# Altium schematic sheet MCU.SchDoc
size A4
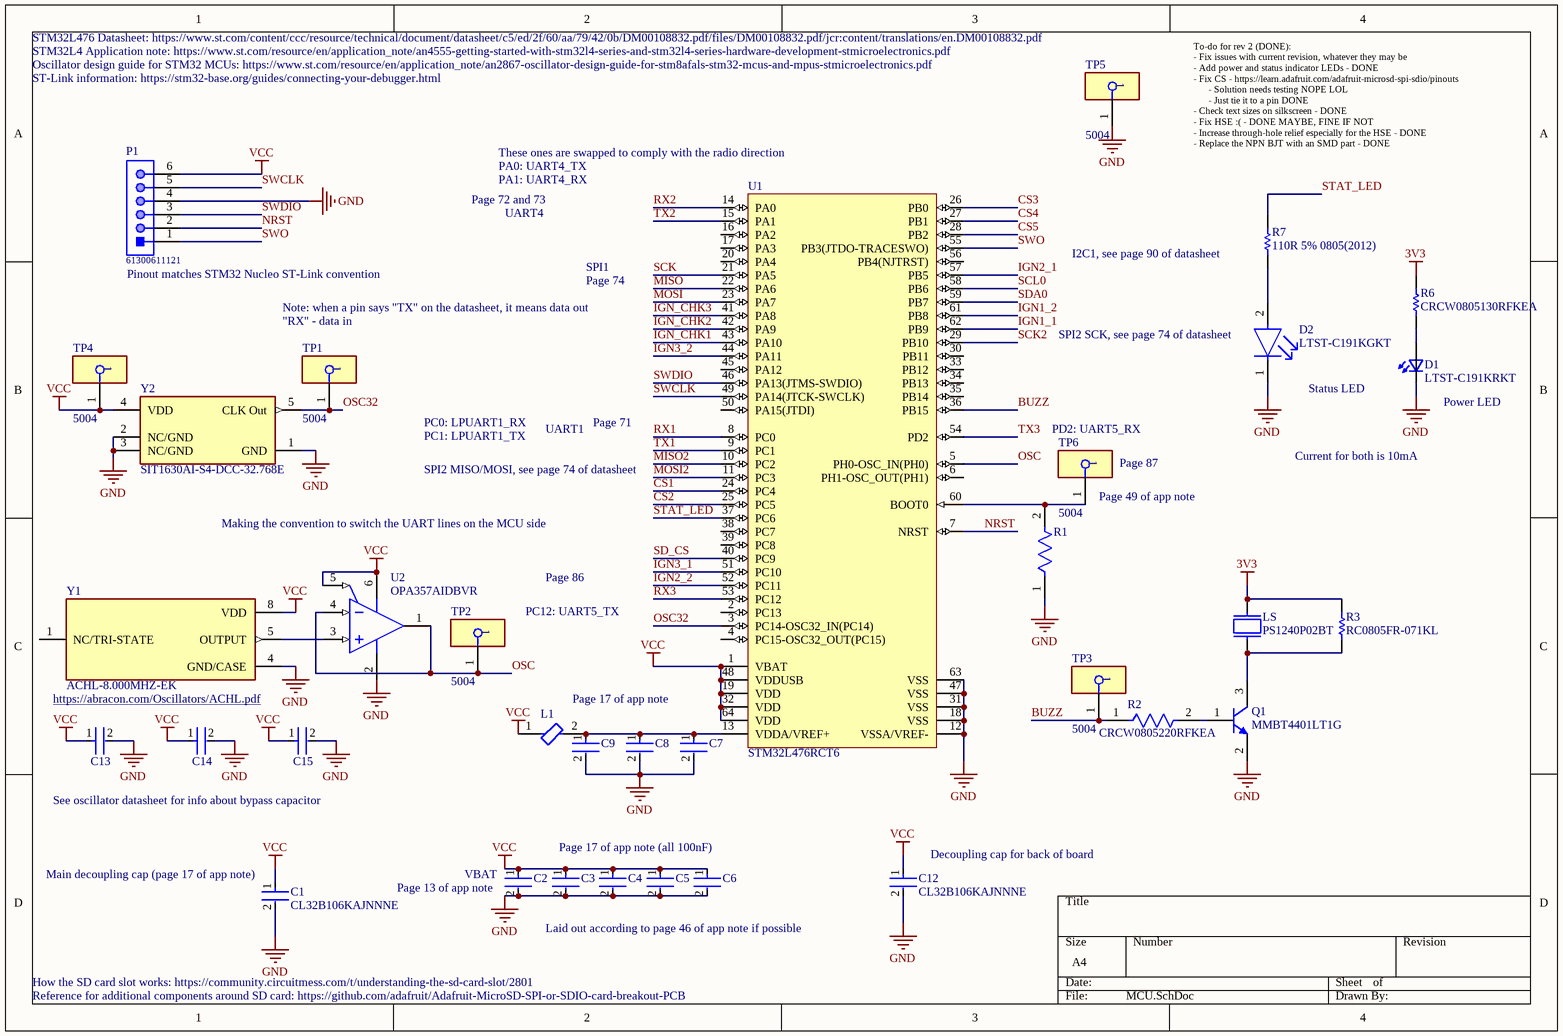
[diagram p0: MCU.SchDoc]

## Parts
C1  CL32B106KAJNNNE  [FP-CL32-IPC_B]
C2  CC0603KRX7R9BB104  [FP-CC0603-DA-MFG]  (value not drawn)
C3  CC0603KRX7R9BB104  [FP-CC0603-DA-MFG]  (value not drawn)
C4  CC0603KRX7R9BB104  [FP-CC0603-DA-MFG]  (value not drawn)
C5  CC0603KRX7R9BB104  [FP-CC0603-DA-MFG]  (value not drawn)
C6  CC0603KRX7R9BB104  [FP-CC0603-DA-MFG]  (value not drawn)
C7  CC0603KRX7R9BB104  [FP-CC0603-DA-MFG]  (value not drawn)
C8  CC0603KRX7R9BB103  [FP-CC0603-DA-MFG]  (value not drawn)
C9  CL10A105KO8NNNC  [FP-CL10-IPC_A]  (value not drawn)
C12  CL32B106KAJNNNE  [FP-CL32-IPC_B]
C13  CC0603KRX7R9BB103  [FP-CC0603-DA-MFG]  (value not drawn)
C14  CC0603KRX7R9BB103  [FP-CC0603-DA-MFG]  (value not drawn)
C15  CL10A105KO8NNNC  [FP-CL10-IPC_A]  (value not drawn)
D1  LTST-C191KRKT  [0603]
D2  LTST-C191KGKT  [FP-LTST-C191KGKT-MFG]
L1  BLM18EG601SN1D  [FP-BLM18-0_15-t0_8-MFG]  (value not drawn)
LS  PS1240P02BT  [XDCR_PS1240P02BT]
P1  61300611121  [61300611121]
Q1  MMBT4401LT1G  [ONSC-SOT-23-3-318-08_V]
R1  AC0805FR-0710KL  [FP-AC0805-MFG]  (value not drawn)
R2  CRCW0805220RFKEA  [FP-CRCW0805-e3-MFG]
R3  RC0805FR-071KL  [RESC2013X60X35ML10T20]
R6  CRCW0805130RFKEA  [RESC2013X50X30ML20T20]
R7  110R 5% 0805(2012)  [RESC0805(2012)_N]
TP1  5004  [FP-5004-MFG]
TP2  5004  [FP-5004-MFG]
TP3  5004  [FP-5004-MFG]
TP4  5004  [FP-5004-MFG]
TP5  5004  [FP-5004-MFG]
TP6  5004  [FP-5004-MFG]
U1  STM32L476RCT6  [STM-LQFP64_L]
U2  OPA357AIDBVR  [DBV0006A_L]
Y1  ACHL-8.000MHZ-EK  [XTAL_ACHL-8.000MHZ-EK]
Y2  SIT1630AI-S4-DCC-32.768E  [FP-SiT1630-S-IPC_A]

## Nets
3V3: LS.2 R3.2 R6.2
GND: C1.2 C2.2 C3.2 C4.2 C5.2 C6.2 C7.2 C8.2 C9.2 C12.2 C13.2 C14.2 C15.2 D1.1(K2) D2.1(C) P1.4 Q1.2(E) R1.1 TP5.1 U1.12(VSSA/VREF-) U1.18(VSS) U1.31(VSS) U1.47(VSS) U1.63(VSS) U2.2(V-) Y1.4(GND/CASE) Y2.1(GND) Y2.2(NC/GND) Y2.3(NC/GND)
VCC: C1.1 C2.1 C3.1 C4.1 C5.1 C6.1 C12.1 C13.1 C14.1 C15.1 L1.1 P1.6 TP4.1 U1.1(VBAT) U1.19(VDD) U1.32(VDD) U1.48(VDDUSB) U1.64(VDD) U2.5(ENABLE) U2.6(V+) Y1.8(VDD) Y2.4(VDD)
BUZZ: R2.1 TP3.1 U1.36(PB15)
CS1: U1.24(PC4)
CS2: U1.25(PC5)
CS3: U1.26(PB0)
CS4: U1.27(PB1)
CS5: U1.28(PB2)
IGN1_1: U1.62(PB9)
IGN1_2: U1.61(PB8)
IGN2_1: U1.57(PB5)
IGN2_2: U1.52(PC11)
IGN3_1: U1.51(PC10)
IGN3_2: U1.44(PA11)
IGN_CHK1: U1.43(PA10)
IGN_CHK2: U1.42(PA9)
IGN_CHK3: U1.41(PA8)
MISO: U1.22(PA6)
MISO2: U1.10(PC2)
MOSI: U1.23(PA7)
MOSI2: U1.11(PC3)
NRST: P1.2 U1.7(NRST)
OSC: TP2.1 U1.5(PH0-OSC_IN(PH0)) U2.1(OUT) U2.4(IN-)
OSC32: TP1.1 U1.3(PC14-OSC32_IN(PC14)) Y2.5(CLK_Out)
RX1: U1.8(PC0)
RX2: U1.14(PA0)
RX3: U1.53(PC12)
SCK: U1.21(PA5)
SCK2: U1.29(PB10)
SCL0: U1.58(PB6)
SD_CS: U1.40(PC9)
SDA0: U1.59(PB7)
STAT_LED: R7.2 U1.37(PC6)
SWCLK: P1.5 U1.49(PA14(JTCK-SWCLK))
SWDIO: P1.3 U1.46(PA13(JTMS-SWDIO))
SWO: P1.1 U1.55(PB3(JTDO-TRACESWO))
TX1: U1.9(PC1)
TX2: U1.15(PA1)
TX3: U1.54(PD2)
NetC7_1: C7.1 C8.1 C9.1 L1.2 U1.13(VDDA/VREF+)
NetD1_2: D1.2(A2) R6.1
NetD2_2: D2.2(A) R7.1
NetLS_1: LS.1 Q1.3(C) R3.1
NetQ1_1: Q1.1(B) R2.2
NetR1_2: R1.2 TP6.1 U1.60(BOOT0)
NetU2_3: U2.3(IN+) Y1.5(OUTPUT)

Not connected (* = marked no-connect by the designer): U1 2(PC13) 4(PC15-OSC32_OUT(PC15)) 6(PH1-OSC_OUT(PH1)) 16(PA2) 17(PA3) 20(PA4) 30(PB11) 33(PB12) 34(PB13) 35(PB14) 38(PC7) 39(PC8) 45(PA12) 50(PA15(JTDI)) 56(PB4(NJTRST)); Y1 1(NC/TRI-STATE)

## Notes on the sheet
- STM32L476 Datasheet: https://www.st.com/content/ccc/resource/technical/document/datasheet/c5/ed/2f/60/aa/79/42/0b/DM00108832.pdf/files/DM00108832.pdf/jcr:content/translations/en.DM00108832.pdf
- (near TP5) STM32L4 Application note: https://www.st.com/resource/en/application_note/an4555-getting-started-with-stm32l4-series-and-stm32l4-series-hardware-development-stmicroelectronics.pdf
- ST-Link information: https://stm32-base.org/guides/connecting-your-debugger.html
- (near TP5) Oscillator design guide for STM32 MCUs: https://www.st.com/resource/en/application_note/an2867-oscillator-design-guide-for-stm8afals-stm32-mcus-and-mpus-stmicroelectronics.pdf
- (near U1) These ones are swapped to comply with the radio direction
- PA0: UART4_TX
- To-do for rev 2 (DONE):
  - Fix issues with current revision, whatever they may be
  - Add power and status indicator LEDs - DONE
  - Fix CS - https://learn.adafruit.com/adafruit-microsd-spi-sdio/pinouts
  - Solution needs testing NOPE LOL
  - Just tie it to a pin DONE
  - Check text sizes on silkscreen - DONE
  - Fix HSE :( - DONE MAYBE, FINE IF NOT
  - Increase through-hole relief especially for the HSE - DONE
  - Replace the NPN BJT with an SMD part - DONE
- Page 72 and 73
- PA1: UART4_RX
- UART4
- (near P1) Pinout matches STM32 Nucleo ST-Link convention
- Note: when a pin says "TX" on the datasheet, it means data out
- Page 74
- SPI1
- (near R7) I2C1, see page 90 of datasheet
- "RX" - data in
- (near D2) SPI2 SCK, see page 74 of datasheet
- PC0: LPUART1_RX
- PC1: LPUART1_TX
- UART1
- Page 71
- (near TP6) PD2: UART5_RX
- Status LED
- (near D1) Power LED
- SPI2 MISO/MOSI, see page 74 of datasheet
- (near TP6) Page 49 of app note
- (near TP6) Page 87
- Current for both is 10mA
- Making the convention to switch the UART lines on the MCU side
- Page 86
- PC12: UART5_TX
- https://abracon.com/Oscillators/ACHL.pdf
- Page 17 of app note
- See oscillator datasheet for info about bypass capacitor
- Page 17 of app note (all 100nF)
- (near C1) Main decoupling cap (page 17 of app note)
- (near C2) Page 13 of app note
- (near C2) VBAT
- (near C12) Decoupling cap for back of board
- How the SD card slot works: https://community.circuitmess.com/t/understanding-the-sd-card-slot/2801
- Laid out according to page 46 of app note if possible
- Reference for additional components around SD card: https://github.com/adafruit/Adafruit-MicroSD-SPI-or-SDIO-card-breakout-PCB

## Library data of the parts
C1 C12 = CMP-13271-001383-1: Cap Ceramic 10uF 25V X7R ±10% SMD 1210 +125°C Embossed T/R; Capacitance: 10uF; Width: 0.098inch; Min Operating Temperature: -55°C; Case Code (Metric): 3225; Case Code (Imperial): 1210; Material: Ceramic; Height: 2.5mm; Depth: 2.5mm; Contact Plating: Tin; Max Operating Temperature: 125°C; Length: 3.2mm; Mount: Surface Mount; Packaging: Tape and Reel; Dielectric: X7R; Tolerance: 10%; Radiation Hardening: No; Thickness: 0.106inch; Package Quantity: 1000; Voltage Rating: 25V; Voltage: 25V; Case/Package: 1210; LCSC Part #: C39232
C2-C7 = CMP-2100-03601-2: CAP CER 0.1UF 50V X7R 0603; Manufacturer: YAGEO; Material: Ceramic; Capacitance: 100 nF; Temperature Coefficient: 15%; Tolerance: 0.1; Value: 100 nF; Height: 0.9mm; Voltage: 50 V; ComponentLink2Description: Datasheet; Device Class L2: Capacitors; Temperature Range High: +125°C; Category: Cap; Footprint Url: http://www.yageo.com/exep/pages/download/literatures/UPY-C_GEN_24.pdf; ComponentLink2URL: http://www.yageo.com/documents/recent/UPY-GPHC_X7R_6.3V-to-50V_18.pdf; Package: CC0603-DA; Temperature: -55°C to +125°C; Voltage Rating: 50 V; Temperature Characteristic: X7R; Device Class L1: Passive Components; Temperature Range Low: -55°C; Manufacturer Part Number: CC0603KRX7R9BB104; RoHS: TRUE; Automotive: No; Device Class L3: Ceramic Capacitors; Octopart: https://octopart.com/cc0603krx7r9bb104-yageo-42244635; Mouser Description: Multilayer Ceramic Capacitor, CC Series, 0.1 - F, - 10%, X7R, 50 V, 0603 [1608 Metric]; Lead Free: Yes; Digikey Description: CAP CER 0.1UF 50V X7R 0603; LCSC Part #: C14663
C8 C13 C14 = CMP-2100-03600-2: CAP CER 10000PF 50V X7R 0603; Manufacturer: YAGEO; Tolerance: 0.1; Material: Ceramic; Temperature Coefficient: 15%; Value: 10 nF; Mouser Description: Multilayer Ceramic Capacitor, CC Series, 0.01 - F, - 10%, X7R, 50 V, 0603 [1608 Metric]; Digikey Description: CAP CER 10000PF 50V X7R 0603; Height: 0.9mm; Category: Cap; Temperature Characteristic: X7R; Footprint Url: http://www.yageo.com/exep/pages/download/literatures/UPY-C_GEN_24.pdf; Lead Free: Yes; Voltage Rating: 50 V; Manufacturer Part Number: CC0603KRX7R9BB103; Temperature: -55°C to +125°C; Device Class L3: Ceramic Capacitors; ComponentLink2Description: Datasheet; Voltage: 50 V; Package: CC0603-DA; Octopart: https://octopart.com/cc0603krx7r9bb103-yageo-192938; Automotive: No; Temperature Range High: +125°C; Temperature Range Low: -55°C; RoHS: TRUE; Device Class L1: Passive Components; ComponentLink2URL: http://www.yageo.com/documents/recent/UPY-GPHC_X7R_6.3V-to-50V_18.pdf; Device Class L2: Capacitors; Capacitance: 10 nF; LCSC Part #: C100042
C9 C15 = CMP-13271-001457-1: Cap Ceramic 1uF 16V X5R ±10% Pad SMD 0603 +85°C T/R; Dielectric: X5R; Height: 0.8mm; Capacitance: 1uF; Mount: Surface Mount; Thickness: 0.035inch; Width: 0.031inch; Min Operating Temperature: -55°C; Contact Plating: Tin; Case Code (Imperial): 0603; Depth: 0.8mm; Length: 1.6mm; Max Operating Temperature: 85°C; Packaging: Tape and Reel; Tolerance: 10%; Radiation Hardening: No; Case/Package: 0603; Package Quantity: 1; Voltage Rating: 16V; Case Code (Metric): 1608; Voltage: 16V; Material: Ceramic; Lead Free: Lead Free; Voltage Rating (DC): 16V; LCSC Part #: C1592
D1 = LTST-C191KRKT: http://octopart.com/ltst-c190krkt-lite-on-549893; Package: None; MP: LTST-C191KRKT; Value: *; Availability: Unavailable; Price: None; LCSC Part #: C125099
D2 = CMP-2000-05198-2: LED GREEN CLEAR SMD; Max Power Dissipation: 75mW; Forward Current: 30mA; Reverse Voltage: 5V; Lens Color: Colorless; Forward Voltage: 2V; Dominant Wavelength: 571nm; Number of LEDs: 1; Viewing Angle: 130°; Lens Style: Rectangular; Test Current: 20mA; Luminous Intensity: 35mcd; Wavelength: 574nm; Width: 0.8mm; Case Code (Imperial): 0603; Number of Pins: 2; Lead Free: Lead Free; Packaging: Tape and Reel; Package Quantity: 1; Min Operating Temperature: -55°C; Case/Package: 0603; Length: 1.6mm; Power Dissipation: 75mW; Depth: 0.8mm; Radiation Hardening: No; Mount: Surface Mount; Max Operating Temperature: 85°C; Color: Green; Power Rating: 75mW; Height: 0.55mm; Illumination Color: Green; Case Code (Metric): 1608; Lens Transparency: Clear; Number of Elements: 1; LCSC Part #: C125098
L1 = CMP-0686-00354-3: Chip Ferrite Bead, 0603, 600Ω @ 100MHz, 0.35Ω, 25%, 500mA; Manufacturer Series: BLM18E; Number of Lines: 1; DC Resistance (DCR): 350mR; Impedance: 600R; Material: Steel; Shielding: Unshielded; Package Quantity: 1; Case/Package: 0603; Length: 1.6mm; Packaging: Tape and Reel; Resistance: 350mR; REACH SVHC: No SVHC; Military Standard: Not; Contact Plating: Tin; Termination: SMD/SMT; Number of Circuits: 1; Width: 0.8mm; Test Frequency: 100MHz; DC Current: 500mA; Case Code (Metric): 1608; Max DC Current: 500mA; Max Operating Temperature: 125°C; Current Rating: 500mA; Series: BLM18E; Tolerance: 25%; Min Operating Temperature: -55°C; Frequency: 100MHz; Lead Free: Lead Free; Terminal Finish: Tin; Number of Pins: 2; Max Current Rating: 500mA; Radiation Hardening: No; Case Code (Imperial): 0603; Number of Functions: 1; Depth: 0.8mm; DC Resistance-Max: 350mR; Height: 0.8mm; Core Material: Ferrite; RoHS Compliant: Yes; LCSC Part #: C20345
LS = PS1240P02BT: Buzzers Transducer, Externally Driven Piezo 3V 4kHz 60dB @ 3V, 10cm Through Hole PC Pins; MF: TDK; MP: PS1240P02BT; Availability: Unavailable; Package: 2020 TDK; Value: *; Price: None; SnapEDA_Link: https://www.snapeda.com/parts/PS1240P02BT/TDK/view-part/53420/?ref=snap
P1 = CMP-1502-01070-1: THT Vertical Pin Header WR-PHD, Pitch 2.54 mm, Single Row, 6 pins; Manufacturer: Wurth Elektronik; Gender: Male; Pin Number: 6; Pitch: 2.54mm; Working Voltage: 250VAC; Rated Current: 3A; Withstanding Voltage: 500VAC; Contact Resistance: 20mOhm; Operating Temperature: -40to105degC; Packaging: Bag; Datasheet URL: https://katalog.we-online.de/em/datasheet/6130xx11121.pdf; Package Reference: 61300611121; Mounting Technology: THT; Publisher: WurthElektronik; Part Number: 61300611121; Manufacturer URL: http://www.we-online.de; Row Number: Single; Orientation: Vertical
Q1 = CMP-1048-00545-1: Switching Transistor, NPN Silicon, 3-Pin SOT-23, Pb-Free, Tape and Reel; Manufacturer: On Semiconductor; IC Continuous (A): 0.6; fT Min (MHz): 250; Mounting Technology: Surface Mount; ComponentLink2URL: http://www.onsemi.cn/pub_link/Collateral/MMBT4401LT1-D.PDF; PackageDescription: 3-Pin Small Outline Transistor, Body 2.92 x 1.3 mm, Pitch 0.95 mm; ComponentLink3Description: Package Specification; Polarity: NPN; PackageReference: SOT-23-3-318-08; PackageVersion: Rev. AP, 11/2009; ComponentLink1URL: http://www.onsemi.com/; ComponentLink3URL: http://www.onsemi.cn/pub_link/Collateral/318-08.PDF; Packing: Tape and Reel; ComponentLink1Description: Manufacturer URL; PartNumber: MMBT4401LT1G; RoHS: TRUE; ComponentLink2Description: Datasheet; DatasheetVersion: Rev. 10; LCSC Part #: C31776
R1 = CMP-2001-04480-2: RES SMD 10K OHM 1% 1/8W 0805; Manufacturer: Yageo; Voltage Rating: 150V; Automotive Grade: Grade 0; Resistance: 10KΩ; Value: 10KΩ; Tolerance: 0.01; Temperature: -55°C to +155°C; Device Class L2: Resistors; RoHS: TRUE; Octopart: https://octopart.com/ac0805fr-0710kl-yageo-21711112; Ipc Land Pattern Name: RESC200125X50; Manufacturer Part Number: AC0805FR-0710KL; ComponentLink2Description: Datasheet; Footprint Url: http://www.yageo.com/exep/pages/download/literatures/PYu-R_Mount_10.pdf; Temperature Range High: +155°C; Digikey Description: RES SMD 10K OHM 1% 1/8W 0805; Package: AC0805; Automotive: Yes; Mouser Description: Res Thick Film 0805 10K Ohm 1% 0.125W(1/8W) ±100ppm/C Epoxy Pad SMD Automotive T/R; Series: AC; ComponentLink2URL: http://www.yageo.com/documents/recent/PYu-AC_51_RoHS_L_6.pdf; Composition: Thick Film; Device Class L3: Chip SMD Resistors; Temperature Range Low: -55°C; Power Rating: 1/8W; Device Class L1: Passive Components; Height: 0.6mm; Lead Free: Yes; Category: Res; LCSC Part #: C140868
R2 = CMP-2001-03682-2: RES Thick Film, 220Ω, 1%, 0.125W, 100ppm/°C, 0805; Max Power Dissipation: 125mW; Voltage Rating: 150V; Resistance: 220R; Packaging: Tape and Reel; Termination: SMD/SMT; Height: 0.45mm; Package Quantity: 10; Width: 0.049inch; Min Operating Temperature: -55°C; Lead Free: Lead Free; Military Standard: Not; Mount: Surface Mount; Max Operating Temperature: 155°C; Voltage Rating (DC): 150V; Composition: Thick Film; Case/Package: 0805; Length: 2mm; Weight: 0.000194oz; Case Code (Metric): 2012; Number of Terminations: 2; Case Code (Imperial): 0805; Radiation Hardening: No; Tolerance: 1%; Features: Automotive AEC-Q200; Power Rating: 125mW; Depth: 1.25mm; Contact Plating: Tin; Temperature Coefficient: 100ppm/°C; LCSC Part #: C844204
R3 = CMP-2100-03671-1: Chip Resistor, 1 KOhm, +/- 1%, 125 mW, -55 to 155 degC, 0805 (2012 Metric), RoHS, Tape and Reel; Manufacturer: Yageo; Temperature Coefficient: 100ppm/degreesC; Voltage Rating (DC): 150V; Max Power Dissipation: 125mW; Resistance: 1KOhm; Number of Pins: 2; Number of Terminations: 2; Datasheet URL: http://www.yageo.com/NewPortal/yageodocoutput?fileName=/pdf/R-Chip/PYu-RC_Group_51_RoHS_L_5.pdf; Length: 0.079inch; Package Description: 2-Pin Surface Mounted Device, Body 2 x 1.25 mm; Depth: 1.25mm; Height: 0.024inch; Military Standard: Not; Case/Package: 0805; Package Reference: 0805; RoHSCompliant: true; Lead Free: LeadFree; Packaging: TapeandReel; Package Quantity: 1; Datasheet Version: Rev. 5, 10/2016; Tolerance: 1%; Min Operating Temperature: -55degC; Voltage Rating: 150V; Composition: ThickFilm; Case Code (Imperial): 0805; Power Rating: 125mW; Width: 0.049inch; Case Code (Metric): 2012; Manufacturer URL: http://www.yageo.com/; Max Operating Temperature: 155degC; REACH SVHC: Unknown; Termination: SMD/SMT; LCSC Part #: C95781
R6 = CMP-2001-04942-1: Manufacturer: Vishay Dale; Part Number: CRCW0805130RFKEA; LCSC Part #: C3151699
R7 = CMP-1013-00051-1: 110R 0.125W 5% 0805 (2012 Metric)  SMD; Value: 110.00 Ohm; Case-EIA: 0805; Case-Metric: 2012; Technology: SMT; Power: 0.125 W; Tolerance: 5 %; LCSC Part #: C246036
TP1-TP6 = CMP-2000-05575-2: PC TEST POINT MINIATURE YELLOW; Manufacturer: Keystone; Number Of Contacts: 1; Is Female: yes; Device Class L1: Connectors; Manufacturer Part Number: 5004; Digikey Description: PC TEST POINT MINIATURE YELLOW; ComponentLink2URL: https://www.keyelco.com/product-pdf.cfm?p=1313; Lead Free: Yes; ComponentLink2Description: Datasheet; Category: Conn; Height: 4.72mm; Octopart: https://octopart.com/5004-keystone-28591; Mouser Description: TEST POINT PC MINI .040"D YELLOW; Device Class L3: unset; Contact Material: Silver; Package: 5004; Automotive: No; Device Class L2: unset; RoHS: TRUE
U1 = CMP-1655-00010-2: Ultra-Low-Power ARM Cortex-M4 32-bit MCU+FPU, 256 KB Flash, 128 KB Internal RAM, 51 I/Os, 64-Pin LQFP, -40 to 85 degC, Tray; Manufacturer: STMicroelectronics; Internal RAM Size (kB): 128; Operating Frequency(F) (Processor speed) (MHz): 80; I/Os (High Current): 51; Supply Voltage(Vcc) min (V): 1.71; D/A Converter: 2; FLASH Size (Prog) (kB): 256; Package Description: 64-Pin Low-profile Quad Flat Package, Body 10 x 10 mm, Pitch 0.5 mm; Packing: Tray; DatasheetVersion: Rev. 4; ComponentLink1URL: http://www.st.com/; Package Reference: LQFP64; Core: ARM Cortex-M4; ComponentLink1Description: Manufacturer URL; ComponentLink2URL: http://www.st.com/st-web-ui/static/active/en/resource/technical/document/datasheet/DM00108832.pdf; ComponentLink2Description: Datasheet; Mounting Technology: Surface Mount; PartNumber: STM32L476RCT6; LCSC Part #: C73245
U2 = CMP-0018-00466-2: 250 MHz, Rail-to-Rail I/O, Single CMOS Operational Amplifier with Shutdown, 2.5 to 5.5 V, -40 to 125 degC, 6-pin SOT23 (DBV6), Green (RoHS & no Sb/Br); Manufacturer: Texas Instruments; Vs(Max)(V): 5.5; Io(Typ)(mA): 100; Iib(Max)(nA): 0.05; Diff Gain(%): 0.02; Sub Family: High Output Current Amplifier (>=50mA), High Speed Amplifier (>=50MHz), Low Supply Voltage Amplifier (<=2.7V); @ MHz: 1; Vn at Flatband(Typ)(nV/rtHz): 6.5; Iq per channel(Max)(mA): 7.5; BW @ Acl(MHz): 250; Slew Rate(Typ)(V/us): 150; Diff Phase(deg): 0.09; Vs(Min)(V): 2.5; 3rd Harmonic(dBc): 83; 2nd Harmonic(dBc): 75; Vio(Max)(mV): 8; THD (Fc is 1 MHz)(Typ)(dB): -74; Settling Time (0.1%)(Typ)(ns): 30; Rail-Rail: In, Out; PackageVersion: 4073253-5/K, 03/2006; ComponentLink3Description: Package Specification; PackageDescription: 6-Pin Plastic Small Outline, Body 1.6 x 2.9 mm, Pitch 0.95 mm; ComponentLink2URL: http://www.ti.com/general/docs/lit/getliterature.tsp?genericPartNumber=OPA357&fileType=pdf; Code_JEDEC: MO-178; PackageReference: DBV0006A; DatasheetVersion: SBOS235E; Number of Channels: 1; ComponentLink1URL: http://www.ti.com/; ComponentLink1Description: Manufacturer URL; PartNumber: OPA357AIDBVR; Mounting Technology: Surface Mount; Acl, min stable gain(V/V): 1; Eco-Plan: Green (RoHS & no Sb/Br); ComponentLink2Description: Datasheet; ComponentLink3URL: http://www.ti.com/litv/pdf/mpds026h; LCSC Part #: C139385
Y2 = CMP-25159-260193-1: MEMS OSC XO 32.7680KHZ LVCMOS; RoHS Compliant: Yes
Y1 = ACHL-8.000MHZ-EK: Package: None; MP: ACHL-8.000MHZ-EK; Value: *; Availability: Unavailable; Price: None